# Altium schematic sheet Control_module.SchDoc
size A4
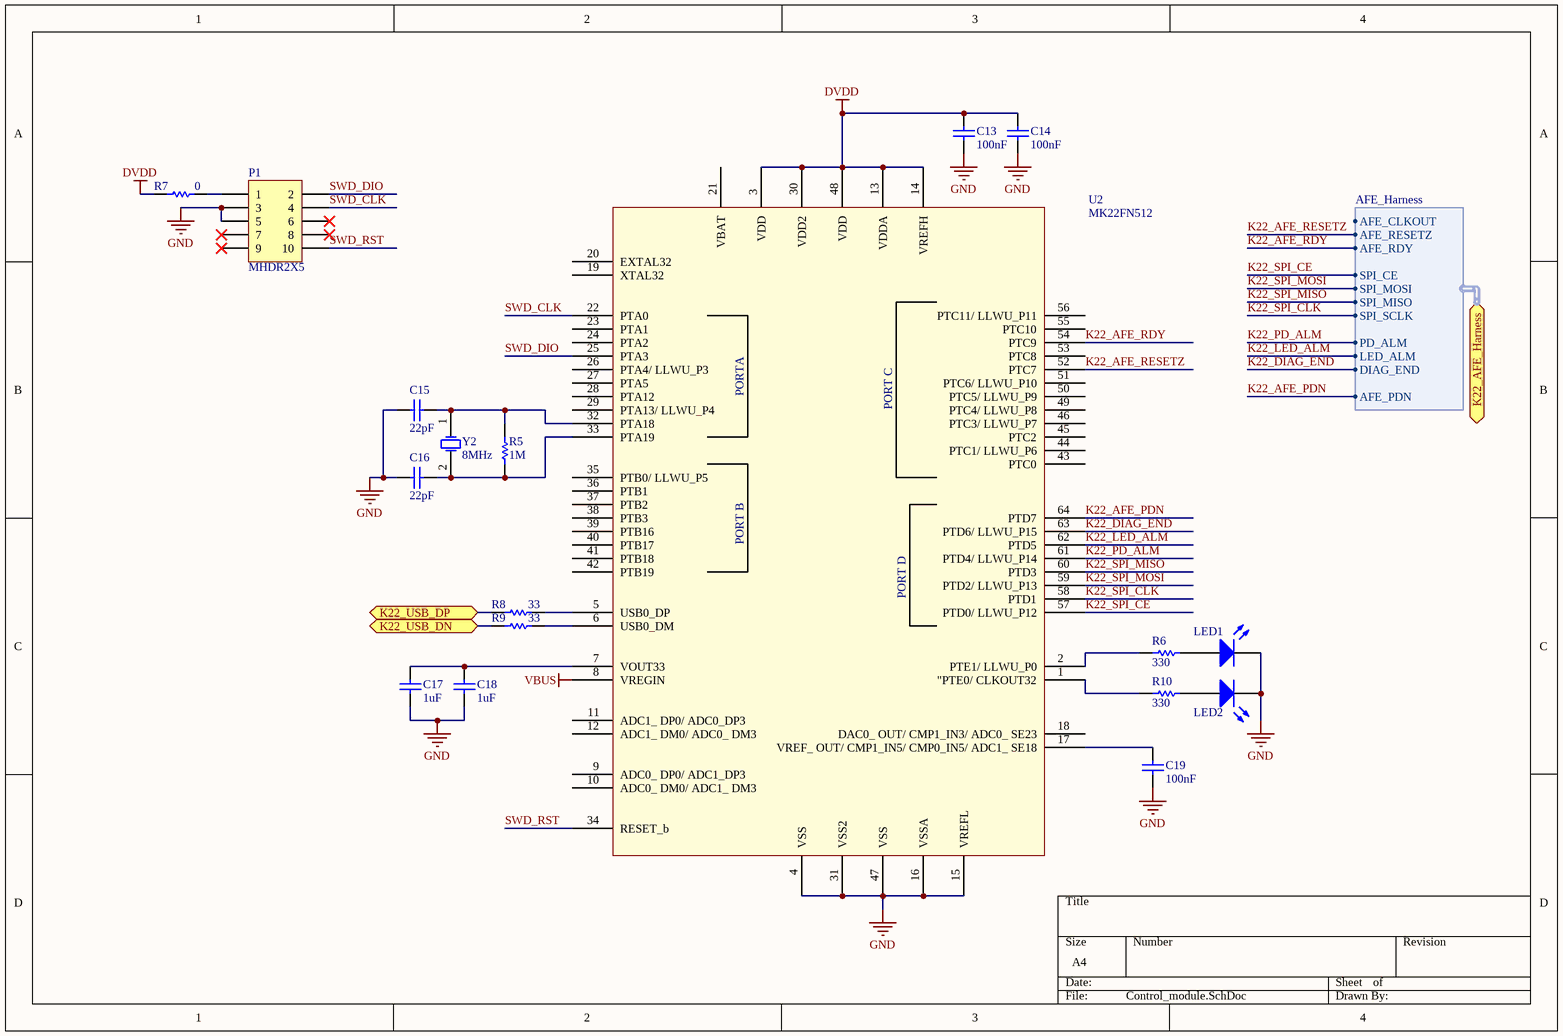
[diagram p0: Control_module.SchDoc]

## Parts
C13  value 100nF  [6-0805_M]  (hidden comment: Cap)
C14  value 100nF  [6-0805_M]  (hidden comment: Cap)
C15  value 22pF  [6-0805_M]  (hidden comment: Cap)
C16  value 22pF  [6-0805_M]  (hidden comment: Cap)
C17  value 1uF  [6-0805_M]  (hidden comment: Cap)
C18  value 1uF  [6-0805_M]  (hidden comment: Cap)
C19  value 100nF  [6-0805_M]  (hidden comment: Cap)
LED1  LED0  [6-0805_M]  (value not drawn)
LED2  LED0  [6-0805_M]  (value not drawn)
P1  MHDR2X5  [MHDR2X5]
R5  value 1M  [6-0805_M]  (hidden comment: Res1)
R6  value 330  [6-0805_M]  (hidden comment: Res1)
R7  value 0  [6-0805_M]  (hidden comment: Res1)
R8  value 33  [6-0805_M]  (hidden comment: Res1)
R9  value 33  [6-0805_M]  (hidden comment: Res1)
R10  value 330  [6-0805_M]  (hidden comment: Res1)
U2  MK22FN512  [MK22FN512_TSQFP50P1200X1200X160-64N]
Y2  8MHz  [Crystal SMD]

## Ports
K22_AFE_Harness (harness AFE_Harness), K22_USB_DN (bidir), K22_USB_DP (bidir)

## Harnesses
AFE_Harness: AFE_CLKOUT, AFE_RESETZ, AFE_RDY, SPI_CE, SPI_MOSI, SPI_MISO, SPI_SCLK, PD_ALM, LED_ALM, DIAG_END, AFE_PDN

## Nets
DVDD: C13.1 C14.1 R7.1 U2.3(VDD) U2.13(VDDA) U2.14(VREFH) U2.30(VDD2) U2.48(VDD)
GND: C13.2 C14.2 C15.1 C16.1 C17.1 C18.1 C19.1 LED1.2(K) LED2.2(K) P1.3 P1.5 U2.4(VSS) U2.15(VREFL) U2.16(VSSA) U2.31(VSS2) U2.47(VSS)
VBUS: U2.8(VREGIN)
K22_AFE_PDN: U2.64(PTD7) ; port K22_AFE_Harness.AFE_PDN
K22_AFE_RDY: U2.54(PTC9) ; port K22_AFE_Harness.AFE_RDY
K22_AFE_RESETZ: U2.52(PTC7) ; port K22_AFE_Harness.AFE_RESETZ
K22_DIAG_END: U2.63(PTD6/_LLWU_P15) ; port K22_AFE_Harness.DIAG_END
K22_LED_ALM: U2.62(PTD5) ; port K22_AFE_Harness.LED_ALM
K22_PD_ALM: U2.61(PTD4/_LLWU_P14) ; port K22_AFE_Harness.PD_ALM
K22_SPI_CE: U2.57(PTD0/_LLWU_P12) ; port K22_AFE_Harness.SPI_CE
K22_SPI_CLK: U2.58(PTD1) ; port K22_AFE_Harness.SPI_SCLK
K22_SPI_MISO: U2.60(PTD3) ; port K22_AFE_Harness.SPI_MISO
K22_SPI_MOSI: U2.59(PTD2/_LLWU_P13) ; port K22_AFE_Harness.SPI_MOSI
K22_USB_DN: R9.1 ; port K22_USB_DN
K22_USB_DP: R8.1 ; port K22_USB_DP
SWD_CLK: P1.4 U2.22(PTA0)
SWD_DIO: P1.2 U2.25(PTA3)
SWD_RST: P1.10 U2.34(RESET_b)
NetC15_2: C15.2 R5.1 U2.32(PTA18) Y2.1(OSC1)
NetC16_2: C16.2 R5.2 U2.33(PTA19) Y2.2(OSC2)
NetC17_2: C17.2 C18.2 U2.7(VOUT33)
NetC19_2: C19.2 U2.17(VREF__OUT/_CMP1_IN5/_CMP0_IN5/_ADC1__SE18)
NetLED1_1: LED1.1(A) R6.2
NetLED2_1: LED2.1(A) R10.2
NetP1_1: P1.1 R7.2
NetR6_1: R6.1 U2.2(PTE1/_LLWU_P0)
NetR8_2: R8.2 U2.5(USB0_DP)
NetR9_2: R9.2 U2.6(USB0_DM)
NetR10_1: R10.1 U2.1("PTE0/_CLKOUT32)

Not connected (* = marked no-connect by the designer): P1 6* 7* 8* 9*; U2 9(ADC0__DP0/_ADC1_DP3) 10(ADC0__DM0/_ADC1__DM3) 11(ADC1__DP0/_ADC0_DP3) 12(ADC1__DM0/_ADC0__DM3) 18(DAC0__OUT/_CMP1_IN3/_ADC0__SE23) 19(XTAL32) 20(EXTAL32) 21(VBAT) 23(PTA1) 24(PTA2) 26(PTA4/_LLWU_P3) 27(PTA5) 28(PTA12) 29(PTA13/_LLWU_P4) 35(PTB0/_LLWU_P5) 36(PTB1) 37(PTB2) 38(PTB3) 39(PTB16) 40(PTB17) 41(PTB18) 42(PTB19) 43(PTC0) 44(PTC1/_LLWU_P6) 45(PTC2) 46(PTC3/_LLWU_P7) 49(PTC4/_LLWU_P8) 50(PTC5/_LLWU_P9) 51(PTC6/_LLWU_P10) 53(PTC8) 55(PTC10) 56(PTC11/_LLWU_P11)

## Notes on the sheet
- (in symbol MK22FN512) PORTA; PORT C; PORT B; PORT D

## Library data of the parts
C13-C19 = Cap: Capacitor; Published: 8-Jun-2000; LatestRevisionDate: 17-Jul-2002; LatestRevisionNote: Re-released for DXP Platform.; PackageReference: RAD-0.3; Publisher: Altium Limited; PackageDescription: Radial Cap, Thru-Hole; 2 Leads; 0.3 in Pin Spacing
LED1 LED2 = LED0: Typical INFRARED GaAs LED; Published: 8-Jun-2000; LatestRevisionDate: 08-Jul-2005; LatestRevisionNote: Mech Layer 1 removed.; PackageReference: LED-0; Publisher: Altium Limited; PackageDescription: LED; 2 Leads
P1 = MHDR2X5: Header, 5-Pin, Dual row; LatestRevisionDate: 17-Jul-2002; LatestRevisionNote: Re-released for DXP Platform.; Publisher: Altium Limited
R5-R10 = Res1: Resistor; Published: 8-Jun-2000; LatestRevisionDate: 17-Jul-2002; LatestRevisionNote: Re-released for DXP Platform.; PackageReference: AXIAL-0.3; Publisher: Altium Limited; PackageDescription: Axial Device, Thru-Hole; 2 Leads; 0.3 in Pin Spacing
U2 = MK22FN512: 120 MHz Cortex-M4 Based Microcontroller with FPU
Y2 = XTAL: Crystal Oscillator; Published: 8-Jun-2000; LatestRevisionDate: 17-Jul-2002; LatestRevisionNote: Re-released for DXP Platform.; PackageReference: R38; Publisher: Altium Limited; PackageDescription: Crystal, Thru-Hole; 2 Leads; Body 3.1 x 8.2 mm (Dia.xH)